# EAGLE design esquema (EAGLE 6.4)
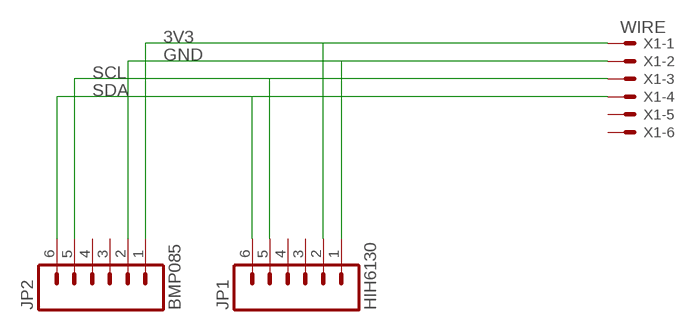
[diagram p0: schematic, sheet 1]

## Parts
JP1  HIH6130  M06SIP  [1X06]
JP2  BMP085  M06SIP  [1X06]
X1  WIRE  22-23-2061  [22-23-2061]

## Nets
3V3: JP1.2 JP2.1 X1.1
GND: JP1.1 JP2.2 X1.2
SCL: JP1.5 JP2.5 X1.3
SDA: JP1.6 JP2.6 X1.4
Unconnected: JP1.3 JP1.4 JP2.3 JP2.4 X1.5 X1.6

## Library data of the parts
JP1 JP2 = SparkFun:M06: Header 6 Standard 6-pin 0.1" header. Use with straight break away headers (SKU : PRT-00116), right angle break away headers (PRT-00553), swiss pins (PRT-00743), machine pins (PRT-00117), and female headers (PRT-00115). Molex polarized connector foot print use with SKU : PRT-08094 with associated crimp pins and housings. NOTES ON THE VARIANTS LOCK and LOCK_LONGPADS... This footprint was designed to help hold the alignment of a through-hole component (i.e. 6-pin header) while soldering it into place. You may notice that each hole has been shifted either up or down by 0.005 of an inch from it's more standard position (which is a perfectly straight line). This slight alteration caused the pins (the squares in the middle) to touch the edges of the holes. Because they are alternating, it causes a "brace" to hold the component in place. 0.005 has proven to be the perfect amount of "off-center" position when using our standard breakaway headers. Although looks a little odd when you look at the bare footprint, once you have a header in there, the alteration is very hard to notice. Also, if you push a header all the way into place, it is covered up entirely on the bottom side. This idea of altering the position of holes to aid alignment will be further integrated into the Sparkfun Library for other footprints. It can help hold any component with 3 or more connection pins.
X1 = con-molex:22-23-2061: .100" (2.54mm) Center Header - 6 Pin; MF: MOLEX; MPN: 22-23-2061; OC_FARNELL: 1462922; OC_NEWARK: 27C1933

## Board
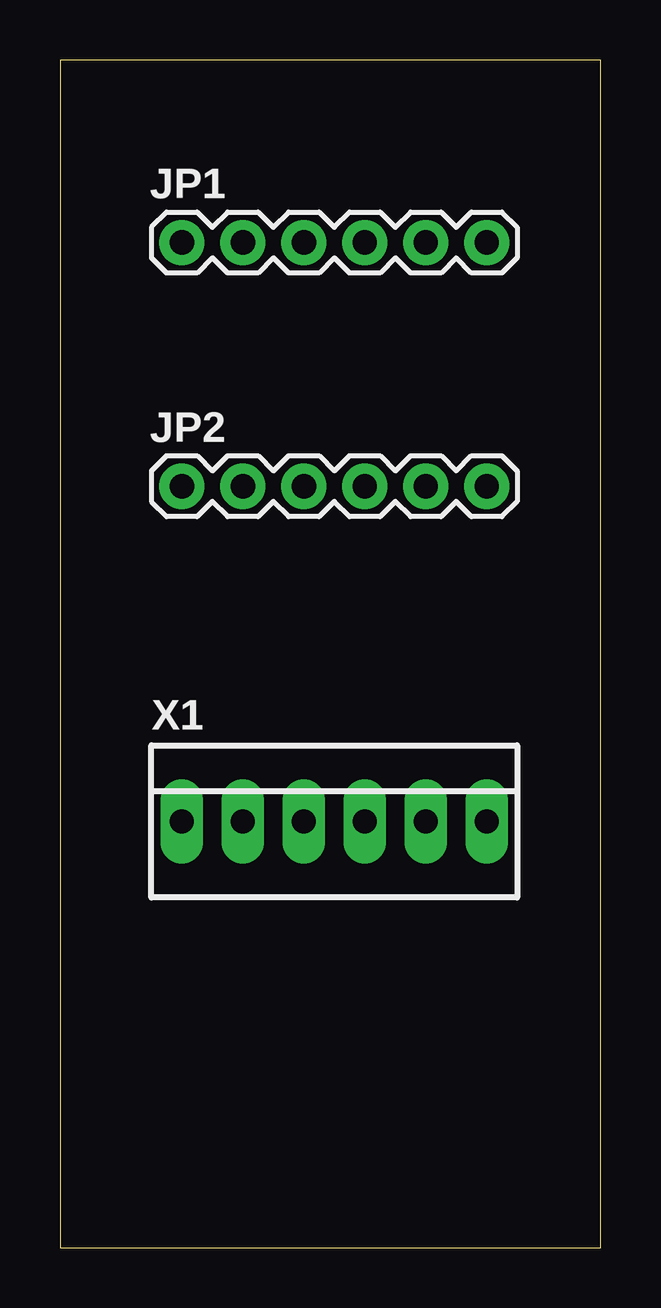
[diagram p1: board, top side]
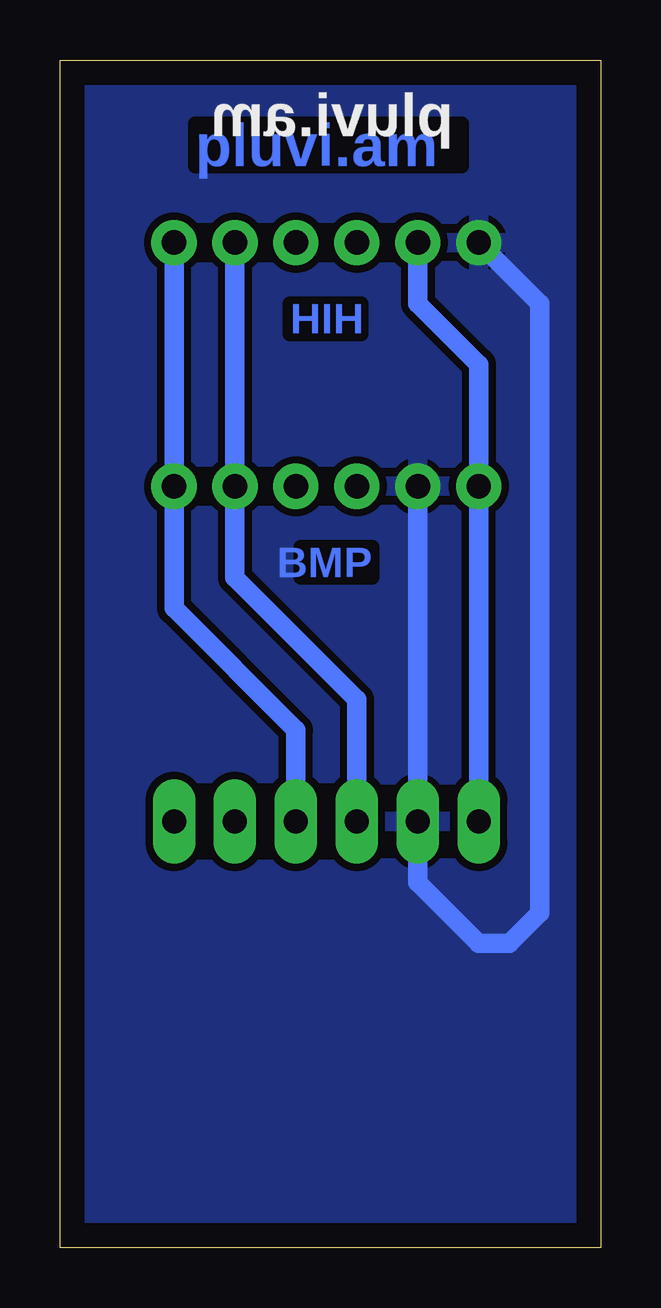
[diagram p2: board, bottom side, seen from below]

Size 22.53 x 49.52 mm. Coordinates in mm from the lower left corner, seen from the top.
Outline: 0,0 22.53,0 22.53,49.52 0,49.52 0,0
Copper layers (1*16): Top 0.035mm / dielectric 1.5mm / Bottom 0.035mm
Design rules "default *": minimum track width 10mil, minimum drill 24mil, track to track 8mil, track to pad 8mil, pad to pad 8mil, via to via 8mil, smd to smd 8mil, copper to edge 40mil, drill to drill 12mil, minimum pad ring 15mil, minimum via ring 8mil, stop-mask expansion 4mil, vias tented up to drill 0mil, thermal gap 10mil

### Footprints (pad centres in the part's own frame; a part is rotated, then mirrored left to right if it is on the bottom)
1X06 = drill 1.016 pad 1.88: 1 0,0; 2 2.54,0; 3 5.08,0; 4 7.62,0; 5 10.16,0; 6 12.7,0
22-23-2061 = drill 1 long: 1 -6.35,0; 2 -3.81,0; 3 -1.27,0; 4 1.27,0; 5 3.81,0; 6 6.35,0

### Placement (x,y rotation side)
JP1  5.08,41.91 0 top
JP2  5.08,31.75 0 top
X1  11.43,17.78 0 top

### Tracks (layer width: path | path; a pad name or v marks a point on that pad's centre or on a via)
3V3
  Bottom 0.813: X1.1 JP2.1 5.08,36.83 7.62,39.37 JP1.2
GND
  Bottom 0.813: JP2.2 X1.2 7.62,15.24 5.08,12.7 3.81,12.7 2.54,13.97 2.54,39.37 JP1.1
  pour Bottom (isolate 0.305): 0,49.53 0,0 22.86,0 22.86,49.53
SCL
  Bottom 0.813: JP1.5 JP2.5 15.24,27.94 10.16,22.86 X1.3
SDA
  Bottom 0.813: X1.4 12.7,21.59 17.78,26.67 JP2.6 JP1.6

### Text on the board
Bottom: pluvi.am | HIH | BMP
bNames: pluvi.am